# EasyEDA Pro project ProPrj_uHatv1.epro

# Schematic Schematic1
Board Name: Board1; Create Date: 2025-07-15; Page Name: P1; Project Name: OpenIPC Raxda Hat; Schematic Name: Schematic1; Update Date: 2025-07-15; Company: EasyEDA.com; Page Size: A4; Version: V1.0
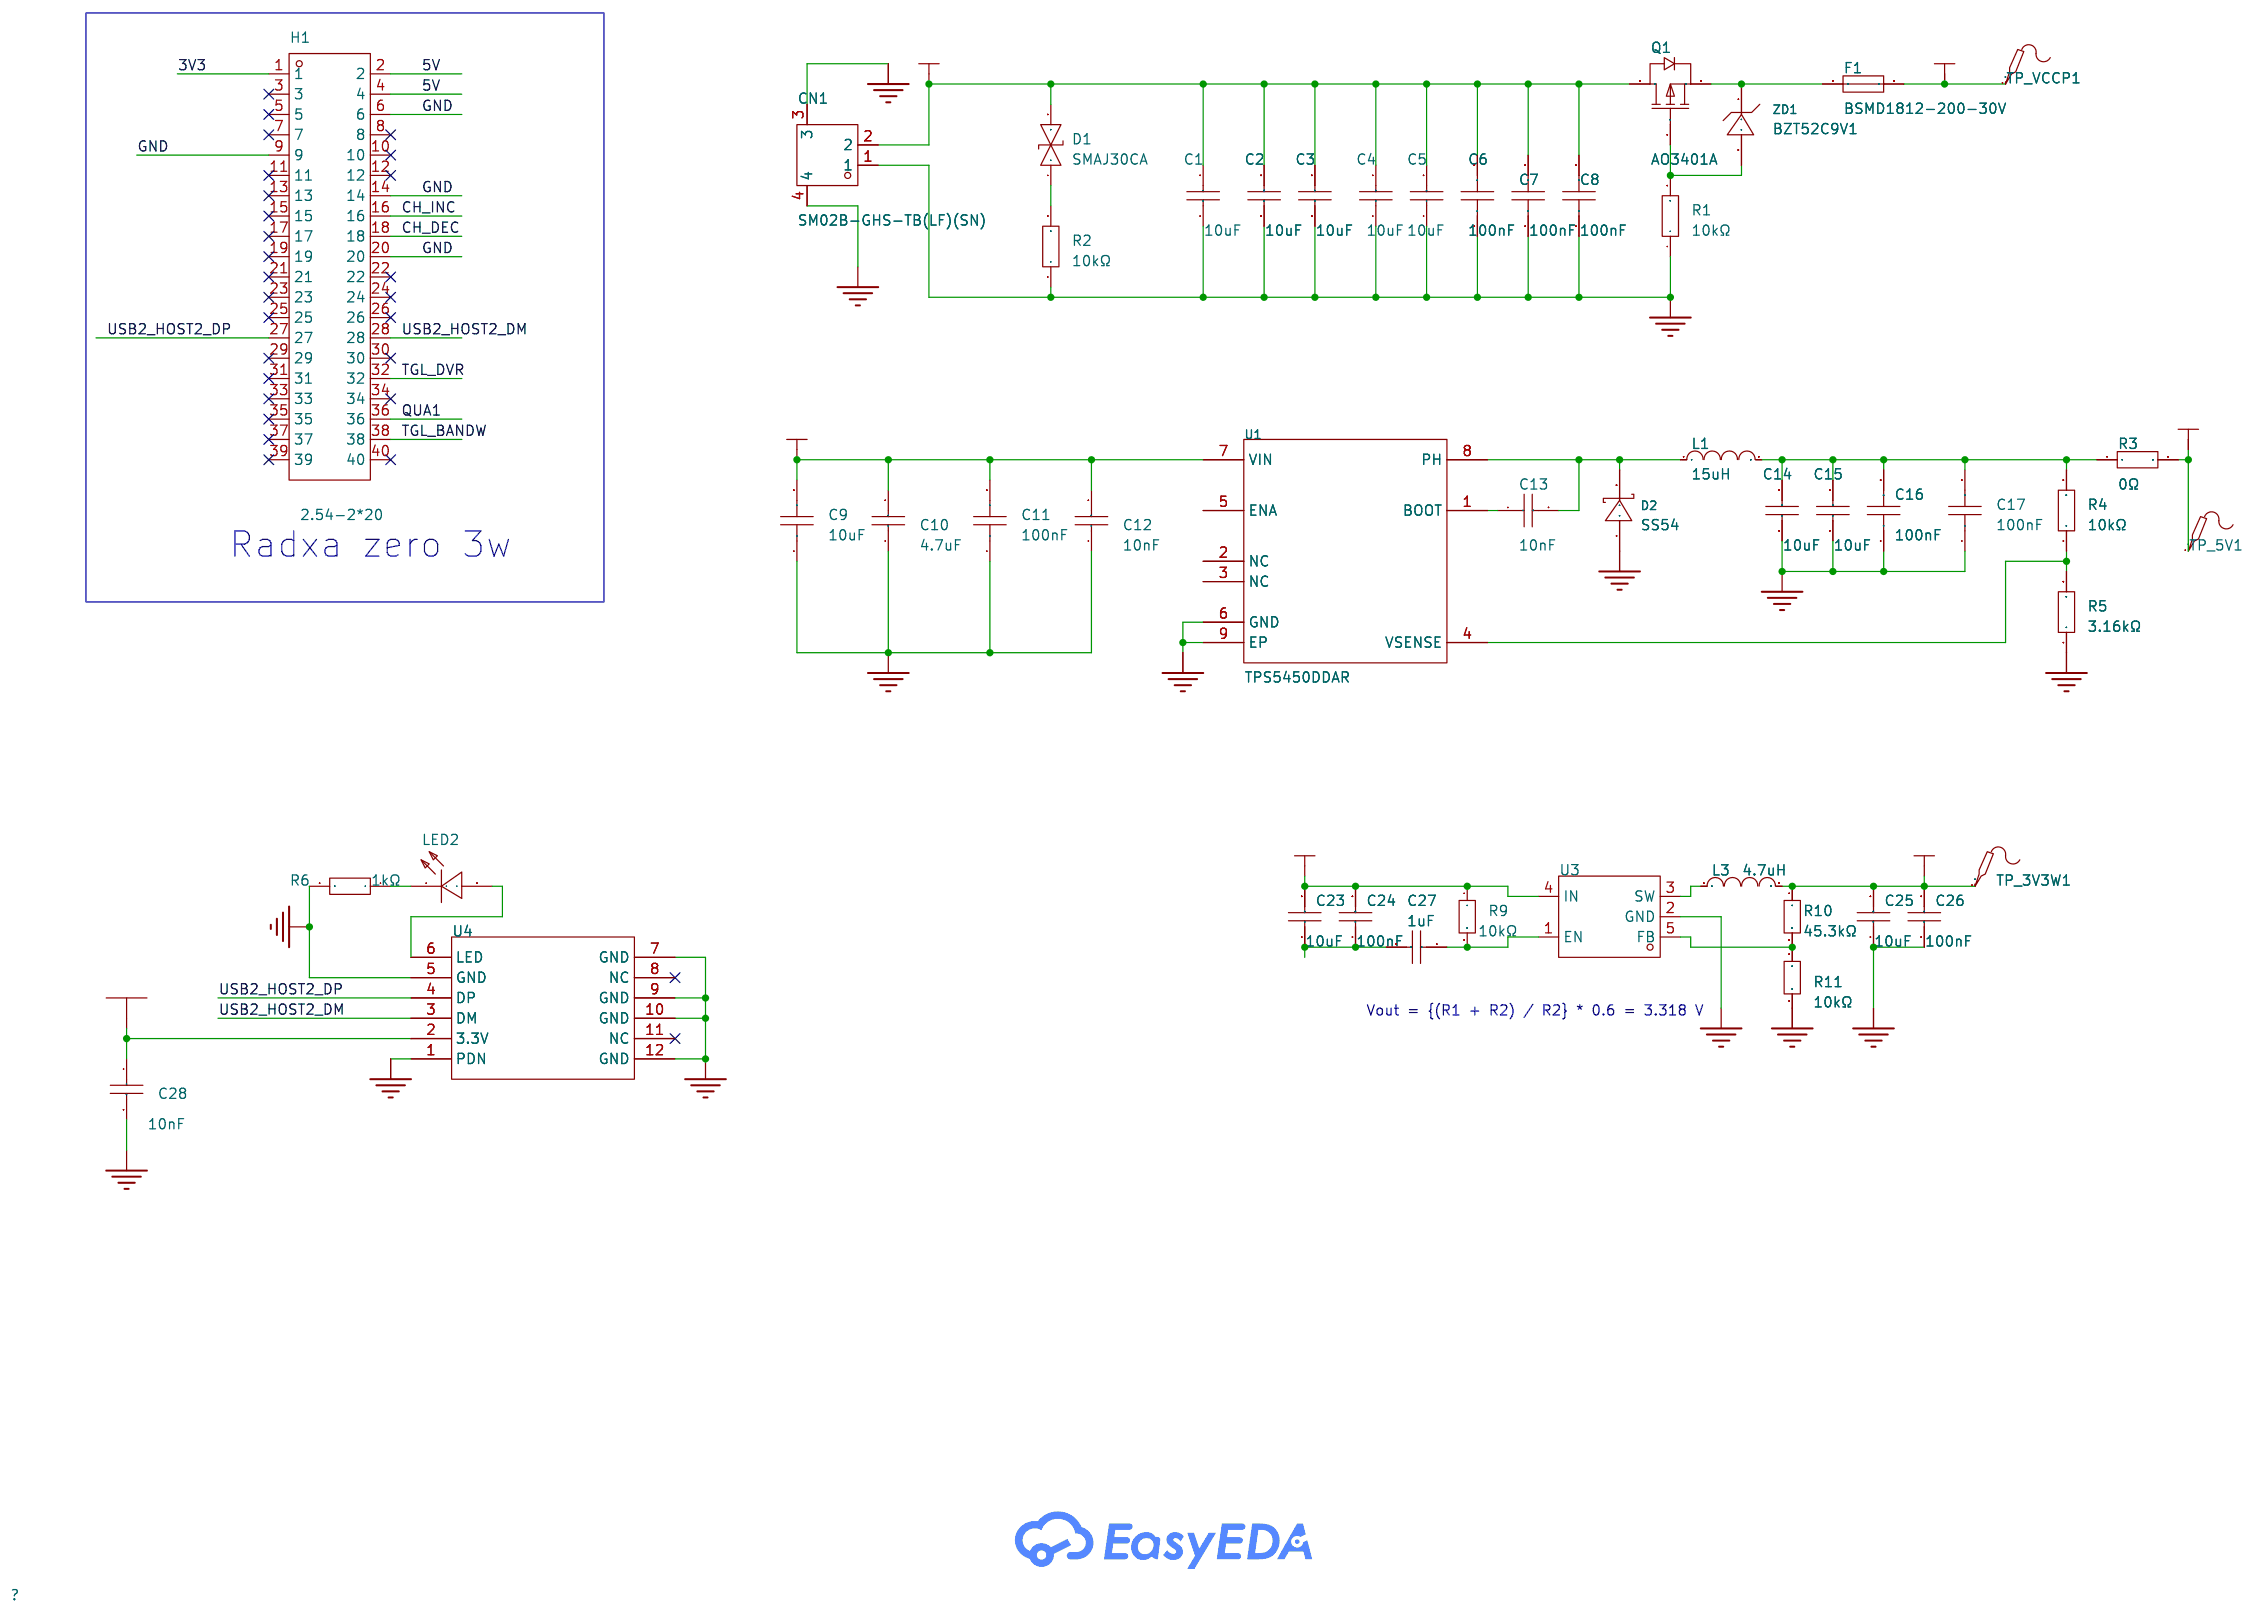
[diagram p0: schematic sheet]

## Parts
C1  10uF  [C1206]
C2  10uF  [C1206]
C3  10uF  [C1206]
C4  10uF  [C1206]
C5  10uF  [C1206]
C6  100nF  [C0603]
C7  100nF  [C0603]
C8  100nF  [C0603]
C9  10uF  [C1206]
C10  4.7uF  [C1206]
C11  100nF  [C0603]
C12  10nF  [C0603]
C13  10nF  [C0603]
C14  10uF  [C1206]
C15  10uF  [C1206]
C16  100nF  [C0603]
C17  100nF  [C0603]
C23  10uF  [C0402]
C24  100nF  [C0402]
C25  10uF  [C0402]
C26  100nF  [C0402]
C27  1uF  [C0402]
C28  10nF  [C0402]
CN1  SM02B-GHS-TB(LF)(SN)  [CONN-SMD_SM02B-GHS-TB-LF-SN]
D1  SMAJ30CA  [SMA_L4.4-W2.6-LS5.0-BI]
D2  SS54  [SMA_L4.3-W2.6-LS5.0-FD]
F1  BSMD1812-200-30V  [F1812]
H1  2.54-2*20  [HDR-TH_40P-P2.54-V-F-R2-C20-S2.54]
L1  15uH  [IND-SMD_L7.3-W6.8]
L3  4.7uH  [L2520]
LED2  NCD0603G1  [LED0603-RD]
Q1  AO3401A  [SOT-23_L2.9-W1.3-P1.90-LS2.4-BR]
R1  10kΩ  [R0603]
R2  10kΩ  [R0603]
R3  0Ω  [R0805]
R4  10kΩ  [R0603]
R5  3.16kΩ  [R0603]
R6  1kΩ  [R0402]
R9  10kΩ  [R0402]
R10  45.3kΩ  [R0402]
R11  10kΩ  [R0402]
TP_3V3W1  -  [Test-Point-0.5mm]
TP_5V1  -  [Test-Point-0.5mm]
TP_VCCP1  -  [Test-Point-0.5mm]
U1  TPS5450DDAR  [SOP-8_L4.9-W3.9-P1.27-LS6.0-BL-EP]
U3  RY3408  [SOT-23-5_L3.0-W1.7-P0.95-LS2.8-BL]
U4  -  [BL-R8812AF1-C]
ZD1  BZT52C9V1  [SOD-123_L2.8-W1.8-LS3.7-RD]

## Library data of the parts
C1-C5 C14 C15 = CL31A106KBHNNNE: 容值:10uF;精度:±10%;额定电压:50V;材质(温度系数):X5R;; LCSC Part Name: 10uF ±10% 50V; Supplier Part: C13585; Manufacturer: SAMSUNG(三星); Supplier Footprint: 1206; JLCPCB Part Class: 基础库; Datasheet: https://atta.szlcsc.com/upload/public/pdf/source/20160103/1457707668742.pdf; Supplier: LCSC; Tolerance: ±10%; Voltage Rated: 50V; Temperature Coefficient: X5R
C6-C8 C11 C16 C17 = CC0603KRX7R9BB104: 容值:100nF;精度:±10%;额定电压:50V;材质(温度系数):X7R;; LCSC Part Name: 100nF ±10% 50V; Supplier Part: C14663; Manufacturer: YAGEO(国巨); Supplier Footprint: 0603; JLCPCB Part Class: Basic Part; Datasheet: https://atta.szlcsc.com/upload/public/pdf/source/20180910/C282072_33301C7F631E79921B82A8DAC6BCC5B3.pdf; Supplier: LCSC; Tolerance: ±10%; Voltage Rated: 50V; Temperature Coefficient: X7R
C9 = CL31B106KBHNNNE: 容值:10uF;精度:±10%;额定电压:50V;材质(温度系数):X7R;; LCSC Part Name: 10uF ±10% 50V; Supplier Part: C89632; Manufacturer: SAMSUNG(三星); Supplier Footprint: 1206; JLCPCB Part Class: Extended Part; Datasheet: https://atta.szlcsc.com/upload/public/pdf/source/20161130/1480498807789.pdf; Supplier: LCSC; Tolerance: ±10%; Voltage Rated: 50V; Temperature Coefficient: X7R
C10 = CL31B475KBHNNNE: 容值:4.7uF;精度:±10%;额定电压:50V;材质(温度系数):X7R;; LCSC Part Name: 4.7uF ±10% 50V; Supplier Part: C51205; Manufacturer: SAMSUNG(三星); Supplier Footprint: 1206; JLCPCB Part Class: 扩展库; Datasheet: https://atta.szlcsc.com/upload/public/pdf/source/20160103/1457707732693.pdf; Supplier: LCSC; Tolerance: ±10%; Voltage Rated: 50V; Temperature Coefficient: X7R
C12 C13 = CC0603KRX7R9BB103: 容值:10nF;精度:±10%;额定电压:50V;材质(温度系数):X7R;; LCSC Part Name: 10nF ±10% 50V; Supplier Part: C100042; Manufacturer: YAGEO(国巨); Supplier Footprint: 0603; JLCPCB Part Class: 扩展库; Datasheet: https://atta.szlcsc.com/upload/public/pdf/source/20180326/C100042_E8B0111D51DE3671A0A4A59FBCEFE81C.pdf; Supplier: LCSC; Tolerance: ±10%; Voltage Rated: 50V; Temperature Coefficient: X7R
C23 C25 = C 0402-10uF: 容值:10uF;精度:±20%;额定电压:6.3V;温度系数:X5R;; LCSC Part Name: 10uF±20%6.3V; Supplier Part: C15525; Manufacturer: SAMSUNG(三星); Manufacturer Part: CL05A106MQ5NUNC; Supplier Footprint: 0402; JLCPCB Part Class: BasicPart; Datasheet: https://atta.szlcsc.com/upload/public/pdf/source/20160103/1457707676445.pdf; Supplier: LCSC; Tolerance: ±20%; Voltage Rated: 6.3V; Temperature Coefficient: X5R
C24 C26 = C 0402-100nF: 容值:100nF;精度:±10%;额定电压:50V;温度系数:X7R;; LCSC Part Name: 100nF±10%50V; Supplier Part: C307331; Manufacturer: SAMSUNG(三星); Manufacturer Part: CL05B104KB54PNC; Supplier Footprint: 0402; JLCPCB Part Class: BasicPart; Datasheet: https://atta.szlcsc.com/upload/public/pdf/source/20181009/C307331_222F7C870FD3EA5F46F538B483443886.pdf; Supplier: LCSC; Tolerance: ±10%; Voltage Rated: 50V; Temperature Coefficient: X7R
C27 = C 0402-1uF: 容值:1uF;精度:±10%;额定电压:25V;温度系数:X5R;; LCSC Part Name: 1uF±10%25V; Supplier Part: C52923; Manufacturer: SAMSUNG(三星); Manufacturer Part: CL05A105KA5NQNC; Supplier Footprint: 0402; JLCPCB Part Class: BasicPart; Datasheet: https://atta.szlcsc.com/upload/public/pdf/source/20160103/1457707735223.pdf; Supplier: LCSC; Tolerance: ±10%; Voltage Rated: 25V; Temperature Coefficient: X5R
C28 = CL05B103KB5NNNC: 容值:10nF;精度:±10%;额定电压:50V;材质(温度系数):X7R;; LCSC Part Name: 10nF ±10% 50V; Supplier Part: C15195; Manufacturer: SAMSUNG(三星); Supplier Footprint: 0402; JLCPCB Part Class: Basic Part; Datasheet: https://atta.szlcsc.com/upload/public/pdf/source/20160218/1457707763339.pdf; Supplier: LCSC; Tolerance: ±10%; Voltage Rated: 50V; Temperature Coefficient: X7R
CN1 = SM02B-GHS-TB(LF)(SN): 插针结构:1x2P;间距:1.25mm;安装方式:卧贴;参考系列:GH;总PIN数:2P;排数:1;每排PIN数:2;行距:-;额定电流:1A;触头材质:磷青铜;触头镀层:锡;工作温度范围:-25℃~+85℃;; LCSC Part Name: 1x2P 间距:1.25mm 卧贴 系列:GH; Supplier Part: C189893; Manufacturer: JST; Supplier Footprint: SMD,P=1.25mm,卧贴; JLCPCB Part Class: Extended Part; Datasheet: https://atta.szlcsc.com/upload/public/pdf/source/20180323/112205B2CF875947C9562BFC7B01FA26.pdf; Supplier: LCSC; Pins Structure: 1x2P; Pitch: 1.25mm; Mounting Style: 卧贴; Reference Series: GH; Number of Pins: 2P; Number of Rows: 1; Number of PINs Per Row: 2; Current Rating (Max): 1A; Contact Material: 磷青铜; Contact Plating: 锡; Operating Temperature Range: -25℃~+85℃; Rated Voltage (Max): 50V; Plastic Material: PA9T; Flame Retardant Rating: UL94V-0; Supplementary Features: 辅助焊脚; Colour: 白色; Z-Height of the Board: 4.25mm; X-Length of Bottom Edge on Board (Spacing Line): 5.75mm; Y-Width of Bottom Edge on Board: 4.13mm
D1 = SMAJ30CA_C110043: 极性:双向;反向截止电压(Vrwm):30V;击穿电压:33.3V;反向漏电流(Ir):1uA;峰值脉冲电流(Ipp)@10/1000μs:8.3A;最大钳位电压:48.4V;; LCSC Part Name: 双向 Vrwm:30V; Supplier Part: C110043; Manufacturer: MDD; Supplier Footprint: SMA(DO-214AC); JLCPCB Part Class: 扩展库; Datasheet: https://atta.szlcsc.com/upload/public/pdf/source/20230314/4319D8044EE29783A53F6AC60595AA71.pdf; Supplier: LCSC; Polarity: 双向; Reverse Stand-Off Voltage (Vrwm): 30V; Breakdown Voltage: 33.3V; Reverse Leakage Current (Ir): 1uA; Peak Pulse Current (Ipp)@10/1000μs: 8.3A; Maximum Clamping Voltage: 48.4V
D2 = SS54_C7420369: 二极管配置:独立式;正向压降(Vf):550mV@5.0A;直流反向耐压(Vr):40V;整流电流:5A;; LCSC Part Name: 电压:40V 电流:5A; Supplier Part: C7420369; Manufacturer: 宏迦橙; Supplier Footprint: SMA(DO-214AC); JLCPCB Part Class: Extended Part; Datasheet: https://atta.szlcsc.com/upload/public/pdf/source/20230828/254C3882F8647358AD9F60DD73611B5E.pdf; Supplier: LCSC; Diode Configuration: 独立式; Forward Voltage (Vf@If): 550mV@5.0A; Reverse Voltage (Vr): 40V; Rectified Current: 5A; Reverse Leakage Current (Ir): 50uA@40V
F1 = BSMD1812-200-30V: 最大电压:30V;最大电流:40A;保持电流:2A;跳闸电流:4A;; LCSC Part Name: 30V 2A 1812自恢复 2秒内动作; Supplier Part: C960026; Manufacturer: BHFUSE(佰宏); Supplier Footprint: 1812; JLCPCB Part Class: Extended Part; Datasheet: https://atta.szlcsc.com/upload/public/pdf/source/20220302/C2BC3E2021B64191B0EAEFE91C1E6D76.pdf; Supplier: LCSC; Operating Voltage (Max): 30V; Current Rating (Max): 40A; Hold Current: 2A; Trip Current: 4A; Power Dissipation: 800mW; Resistance - Initial (Ri) (Min): 20mΩ; Resistance - Post Trip (R1) (Max): 100mΩ; Maximum Time to Trip: 2s; Operating Temperature: -40℃~+85℃
H1 = 2.54-2*20: 插孔结构:2x20P;间距:2.54mm;行距:2.54mm;圆孔/方孔:方孔;安装类型:直插;排数:双排;总孔位数:40P;额定电流:2.5A;额定电压:-;插孔方向:顶部;塑高:8.5mm;工作温度范围:-40℃~+105℃;; LCSC Part Name: 间距:2.54mm 2x20P 直插; Supplier Part: C2977589; Manufacturer: ZHOURI(洲日); Supplier Footprint: 插件,P=2.54mm; JLCPCB Part Class: Extended Part; Datasheet: https://atta.szlcsc.com/upload/public/pdf/source/20220328/834E302BE3C038BBC5C70F5E02589B1E.pdf; Supplier: LCSC; Holes Structure: 2x20P; Pitch: 2.54mm; Row Spacing: 2.54mm; Circular Hole / Square Hole: 方孔; Mounting Type: 直插; Number of Rows: 双排; Number of Holes: 40P; Current Rating (Max): 2.5A; Holes Direction: 顶部; Insulation Height: 8.5mm; Operating Temperature Range: -40℃~+105℃
L1 = MWSA0603S-150MT: 精度:±20%;额定电流:3A;电感值:15uH;直流电阻(DCR):113mΩ;; LCSC Part Name: 15uH ±20%; Supplier Part: C408452; Manufacturer: Sunlord(顺络); Supplier Footprint: SMD; JLCPCB Part Class: Extended Part; Datasheet: https://atta.szlcsc.com/upload/public/pdf/source/20190729/C408452_7F0A9CFF0AB8A0D8AD496F52F1F29DF7.pdf; Supplier: LCSC; Width: 7mm; Tolerance: ±20%; Length: 6.6mm; Height: 3mm; Rated Current: 3A; DC Resistance (DCR): 113mΩ
L3 = SLO252012F4R7MTT: 电感值:4.7uH;精度:±20%;额定电流:1.55A;; LCSC Part Name: 4.7uH ±20%; Supplier Part: C275675; Manufacturer: Sunltech(韩国顺磁); Supplier Footprint: SMD; JLCPCB Part Class: Extended Part; Datasheet: https://atta.szlcsc.com/upload/public/pdf/source/20180827/C275675_14A9C48955D3808CE02CC0CFD834A432.pdf; Supplier: LCSC; Tolerance: ±20%; Rated Current: 1.55A; DC Resistance (DCR): 237mΩ; Saturation Current (Isat): 1.1A
LED2 = NCD0603G1: 发光颜色:翠绿色;正向电压(VF):2.6V~3.6V;功率:72mW;正向电流:10mA;主波长:515nm~530nm;透镜颜色:无色透明透镜;发光强度:330mcd~900mcd;发光角度:130°;工作温度:-30℃~+85℃;; Supplier Part: C84267; Manufacturer: 国星光电; Supplier Footprint: 0603; JLCPCB Part Class: Extended Part; Datasheet: https://atta.szlcsc.com/upload/public/pdf/source/20200820/C84267_04BA7703640BAC111D09F5EFB971FBF3.pdf; Supplier: LCSC; Emitted Color: 翠绿色; Forward Voltage (VF): 2.6V~3.6V; Power Dissipation: 72mW; Forward Current: 10mA; Dominant Wavelength: 515nm~530nm; Lens Color: 无色透明透镜; Luminous Intensity: 330mcd~900mcd; Viewing Angle: 130°; Operating Temperature: -30℃~+85℃; Peak Wavelength: 591nm
Q1 = AO3401A_C15127: 类型:P沟道;漏源电压(Vdss):30V;连续漏极电流(Id):4A;功率(Pd):1.4W;导通电阻(RDS(on)@Vgs,Id):44mΩ@10V,4.3A;; LCSC Part Name: P沟道 30V 4A; Supplier Part: C15127; Manufacturer: AOS; Supplier Footprint: SOT-23-3L; JLCPCB Part Class: 基础库; Datasheet: https://atta.szlcsc.com/upload/public/pdf/source/20160507/1462613609053.pdf; Supplier: LCSC; Type: P沟道; Drain Source Voltage (Vdss): 30V; Continuous Drain Current (Id): 4A; Power Dissipation (Pd): 1.4W; Drain Source On Resistance (RDS(on)@Vgs,Id): 44mΩ@10V,4.3A; Gate Threshold Voltage (Vgs(th)@Id): 1.3V@250uA
R1 R2 R4 = RC0603FR-0710KL: 电阻类型:厚膜电阻;阻值:10kΩ;精度:±1%;功率:100mW;; LCSC Part Name: 10kΩ ±1% 100mW; Supplier Part: C98220; Manufacturer: YAGEO(国巨); Supplier Footprint: 0603; JLCPCB Part Class: Extended Part; Datasheet: https://atta.szlcsc.com/upload/public/pdf/source/20170522/1495423494387.pdf; Supplier: LCSC; Type: 厚膜电阻; Tolerance: ±1%; Power(Watts): 100mW; Temperature Coefficient: ±100ppm/℃; Overload Voltage (Max): 75V; Operating Temperature Range: -55℃~+155℃
R3 = RC0805FR-070RL: 电阻类型:厚膜电阻;阻值:0Ω;精度:-;功率:125mW;; LCSC Part Name: 0Ω 125mW; Supplier Part: C100045; Manufacturer: YAGEO(国巨); Supplier Footprint: 0805; JLCPCB Part Class: Extended Part; Datasheet: https://atta.szlcsc.com/upload/public/pdf/source/20180308/C100045_15204885362631413773.pdf; Supplier: LCSC; Type: 厚膜电阻; Power(Watts): 125mW; Overload Voltage (Max): 150V; Operating Temperature Range: -55℃~+155℃
R5 = RC0603FR-073K16L: 电阻类型:厚膜电阻;阻值:3.16kΩ;精度:±1%;功率:100mW;; LCSC Part Name: 3.16kΩ ±1% 100mW; Supplier Part: C185333; Manufacturer: YAGEO(国巨); Supplier Footprint: 0603; JLCPCB Part Class: Extended Part; Datasheet: https://atta.szlcsc.com/upload/public/pdf/source/20180316/A6294E2A48ABAC6B69EFA6CF57598B5C.pdf; Supplier: LCSC; Type: 厚膜电阻; Tolerance: ±1%; Power(Watts): 100mW; Temperature Coefficient: ±100ppm/℃; Overload Voltage (Max): 75V; Operating Temperature Range: -55℃~+155℃
R6 = 0402WGF1001TCE: 电阻类型:厚膜电阻;阻值:1kΩ;精度:±1%;功率:62.5mW;最大工作电压:50V;温度系数:±100ppm/℃;; LCSC Part Name: 1kΩ ±1% 62.5mW 厚膜电阻; Supplier Part: C11702; Manufacturer: UNI-ROYAL(厚声); Supplier Footprint: 0402; JLCPCB Part Class: Basic Part; Datasheet: https://atta.szlcsc.com/upload/public/pdf/source/20200306/C422600_1E6D84923E4A46A82E41ADD87F860B5C.pdf; Supplier: LCSC; Type: 厚膜电阻; Tolerance: ±1%; Power(Watts): 62.5mW; Overload Voltage (Max): 50V; Temperature Coefficient: ±100ppm/℃; Operating Temperature Range: -55℃~+155℃; Voltage Rated: 50V
R9 = RC0402FR-0710KL: 电阻类型:厚膜电阻;阻值:10kΩ;精度:±1%;功率:62.5mW;最大工作电压:50V;温度系数:±100ppm/℃;; LCSC Part Name: 厚膜电阻 10kΩ ±1% 62.5mW; Supplier Part: C60490; Manufacturer: YAGEO(国巨); Supplier Footprint: 0402; JLCPCB Part Class: Extended Part; Datasheet: https://atta.szlcsc.com/upload/public/pdf/source/20170925/C131467_1506321478108990263.pdf; Supplier: LCSC; Type: 厚膜电阻; Tolerance: ±1%; Power(Watts): 62.5mW; Overload Voltage (Max): 50V; Temperature Coefficient: ±100ppm/℃; Operating Temperature Range: -55℃~+155℃
R10 = 0402WGF4532TCE: 电阻类型:厚膜电阻;阻值:45.3kΩ;精度:±1%;功率:62.5mW;最大工作电压:50V;温度系数:±100ppm/℃;; LCSC Part Name: 45.3kΩ ±1% 62.5mW 厚膜电阻; Supplier Part: C26980; Manufacturer: UNI-ROYAL(厚声); Supplier Footprint: 0402; JLCPCB Part Class: Extended Part; Datasheet: https://atta.szlcsc.com/upload/public/pdf/source/20200306/C422600_1E6D84923E4A46A82E41ADD87F860B5C.pdf; Supplier: LCSC; Type: 厚膜电阻; Tolerance: ±1%; Power(Watts): 62.5mW; Overload Voltage (Max): 50V; Temperature Coefficient: ±100ppm/℃; Operating Temperature Range: -55℃~+155℃
R11 = R0402-10K: 电阻类型:厚膜电阻;阻值:10kΩ;精度:±1%;功率:1/16W;温度系数:±100ppm/;最大工作电压:50V;工作温度范围:-55~+155;; LCSC Part Name: 10kΩ ±1%; Supplier Part: C25744; Manufacturer: UNI-ROYAL(厚声); Manufacturer Part: 0402WGF1002TCE; Supplier Footprint: 0402; JLCPCB Part Class: Basic Part; Datasheet: https://atta.szlcsc.com/upload/public/pdf/source/20200306/C422600_1E6D84923E4A46A82E41ADD87F860B5C.pdf; Supplier: LCSC; Type: 厚膜电阻; Tolerance: ±1%; Power(Watts): 1/16W; Temperature Coefficient: ±100ppm/; Overload Voltage (Max): 50V; Operating Temperature Range: -55~+155
TP_3V3W1 TP_5V1 TP_VCCP1 = Test-Point: Test Point 测试点
U1 = TPS5450DDAR: 功能类型:降压型;同步整流:否;输出类型:可调;输出通道数:1;拓扑结构:降压式;输入电压:5.5V~36V;输出电压:1.221V~31.32V;输出电流(最大值):5A;开关频率:500kHz;工作温度:-40℃~+125℃@(TJ);; LCSC Part Name: 降压型 Vin=5.5V~36V Vout=1.221V~31.32V 5A; Supplier Part: C114425; Manufacturer: TI(德州仪器); Supplier Footprint: SOP-8-EP; JLCPCB Part Class: 扩展库; Datasheet: https://atta.szlcsc.com/upload/public/pdf/source/20170620/1497944765773.pdf; Supplier: LCSC; Function: 降压型; Synchronous Rectification: 否; Output Type: 可调; Number of Outputs: 1; Topology: 降压式; Input Voltage: 5.5V~36V; Output Voltage: 1.221V~31.32V; Output Current (Max): 5A; Switching Frequency: 500kHz; Operating Temperature: -40℃~+125℃@(TJ)
U3 = RY3408: LCSC Part Name: RY3408 Buck, 2.5-5.5V, 1.0A, 1.5MHz, VFB 0.6V, SOT23-5; Supplier Part: C370750; Manufacturer: RYCHiP(蕊源); Supplier Footprint: SOT-23-5; JLCPCB Part Class: Extended Part; Datasheet: https://atta.szlcsc.com/upload/public/pdf/source/20190401/C370750_391097459A1376D00374F95CC0163C7D.pdf; Supplier: LCSC
U4 = BL-R8812AF1
ZD1 = BZT52C9V1_C2123: 二极管配置:独立式;稳压值(标称值):9.1V;稳压值(范围):8.5V~9.6V;精度:-;功率:350mW;; Supplier Part: C2123; Manufacturer: CJ(江苏长电/长晶); Supplier Footprint: SOD-123; JLCPCB Part Class: Extended Part; Datasheet: https://atta.szlcsc.com/upload/public/pdf/source/20120428/1457706480557.pdf; Supplier: LCSC; Diode Configuration: 独立式; Zener Voltage (Nom): 9.1V; Zener Voltage (Range): 8.5V~9.6V; Power Dissipation: 350mW; Reverse Leakage Current (Ir): 500nA@6V; Zener Impedance (Zzt): 15Ω

## Nets
3V3: H1.1
3V3_WF: C25.2 C26.2 C28.1 L3.2 R10.1 TP_3V3W1.1 U4.2(3.3V)
5V: C23.2 C24.2 H1.2 H1.4 R3.2 R9.1 TP_5V1.1 U3.4(IN)
GND: C1.1 C2.1 C3.1 C4.1 C5.1 C6.1 C7.1 C8.1 C9.1 C10.1 C11.1 C12.1 C14.1 C15.1 C16.1 C17.1 C25.1 C26.1 C28.2 CN1.1 CN1.3 CN1.4 D2.1(A) H1.6 H1.9 H1.14 H1.20 R1.1 R2.1 R5.1 R6.2 R11.1 U1.6(GND) U1.9(EP) U3.2(GND) U4.1(PDN) U4.5(GND) U4.7(GND) U4.9(GND) U4.10(GND) U4.12(GND)
VCC_IN: C1.2 C2.2 C3.2 C4.2 C5.2 C6.2 C7.2 C8.2 CN1.2 D1.2 Q1.3(D)
VCC_P: C9.2 C10.2 C11.2 C12.2 F1.2 TP_VCCP1.1 U1.7(VIN)
CH_DEC: H1.18
CH_INC: H1.16
QUA1: H1.36
TGL_BANDW: H1.38
TGL_DVR: H1.32
USB2_HOST2_DM: H1.28 U4.3(DM)
USB2_HOST2_DP: H1.27 U4.4(DP)
$1N718: C13.1 U1.1(BOOT)
$1N720: C13.2 D2.2(K) L1.1 U1.8(PH)
$1N722: R4.1 R5.2 U1.4(VSENSE)
$1N724: C14.2 C15.2 C16.2 C17.2 L1.2 R3.1 R4.2
$1N1789: Q1.1(G) R1.2 ZD1.2(A)
$1N1790: D1.1 R2.2
$1N1792: F1.1 Q1.2(S) ZD1.1(K)
$1N2681: R10.2 R11.2 U3.5(FB)
$1N2683: C23.1 C24.1 C27.2
$1N2685: C27.1 R9.2 U3.1(EN)
$1N2687: L3.1 U3.3(SW)
$1N3406: LED2.1(K) R6.1
$1N3407: LED2.2(A) U4.6(LED)

Not connected (* = marked no-connect by the designer): H1 3* 5* 7* 8* 10* 11* 12* 13* 15* 17* 19* 21* 22* 23* 24* 25* 26* 29* 30* 31* 33* 34* 35* 37* 39* 40*; U1 2(NC) 3(NC) 5(ENA); U4 8(NC)* 11(NC)*

## Notes on the sheet
- Radxa zero 3w
- Vout = {(R1 + R2) / R2} * 0.6 = 3.318 V

# Board PCB1
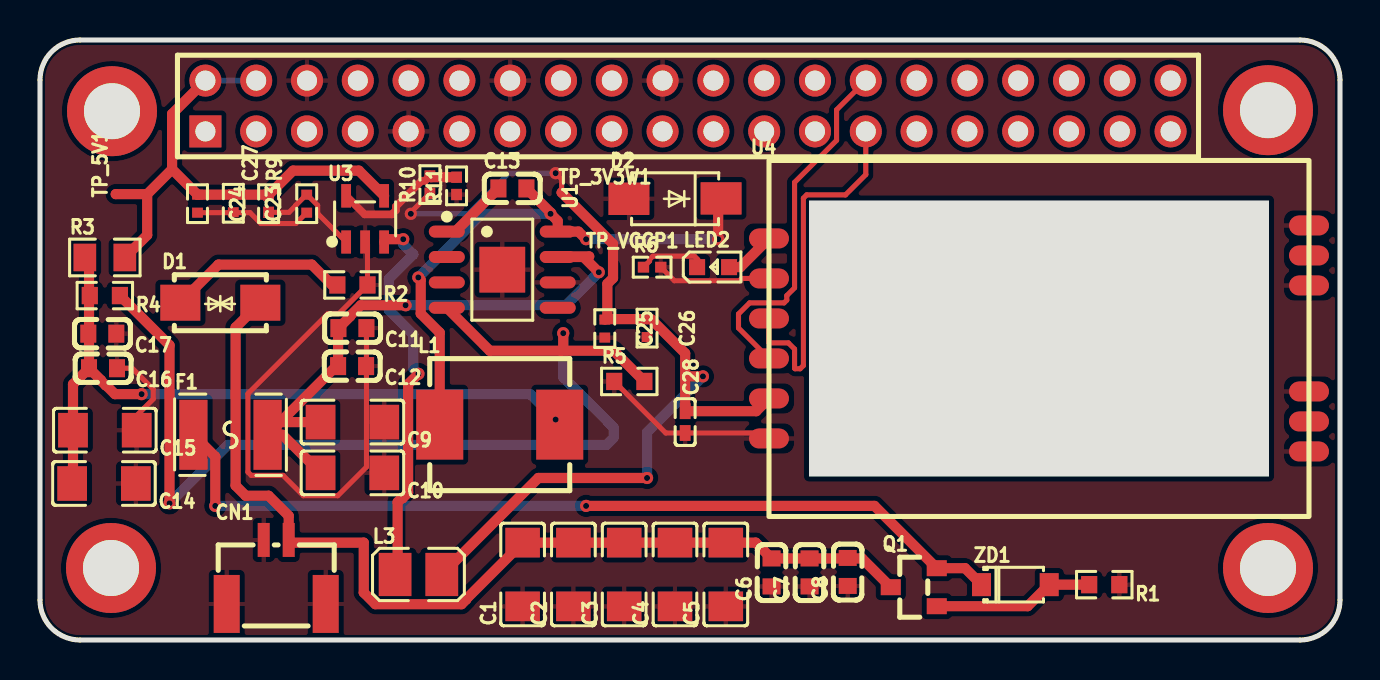
[diagram p1: board, top side]
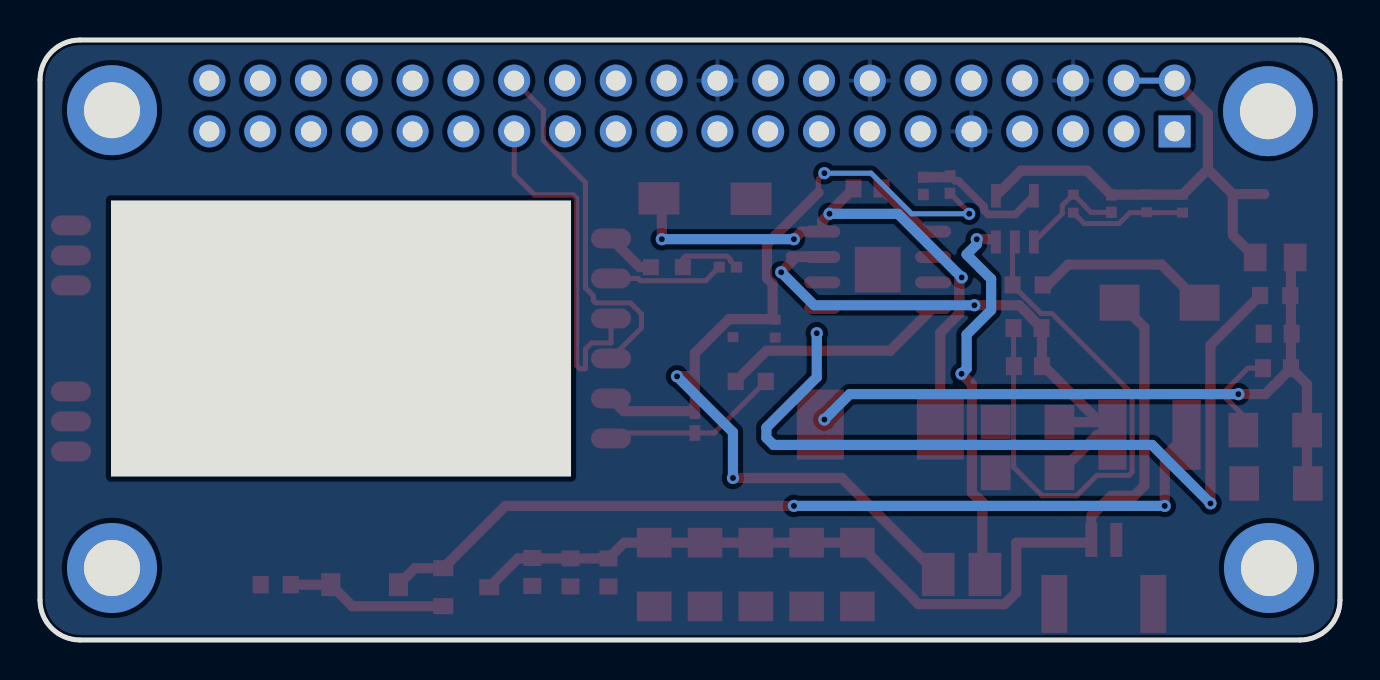
[diagram p2: board, bottom side, seen from below]

Outline 65 x 30 mm; copper layers: Top Layer, Inner1, Inner2, Bottom Layer. Coordinates in mm from the lower left corner of the outline.
Outline path: 0,28 0,2 arc(0.59,0.59) 2,0 63,0 arc(64.41,0.59) 65,2 65,28 arc(64.41,29.41) 63,30 2,30 arc(0.59,29.41) 0,28
Stack: Top Layer 0.035mm / Dielectric1 1.51mm FR4 er 4.5 / Inner1 0.035mm / Dielectric2 0.48mm PP er 4.5 / Inner2 0.035mm / Dielectric3 0.48mm PP er 4.5 / Bottom Layer 0.035mm

## Design rules (mm)
net USB2_HOST2_DM: DP1
net USB2_HOST2_DP: DP1
template: JLCPCB Capability(Two Layers Board)
spacing copperThickness1oz (default): track to track 0.102, other pairs 0.152 to 0.3
spacing copperThickness2oz: track to track 0.203, other pairs 0.152 to 0.3
track width copperThickness1oz (default): min 0.127, default 0.254, max 2.54
track width copperThickness2oz: min 0.203, default 0.254, max 2.54
differential pair differentialPair (default): width min 0.127, default 0.254, max 2.54; gap min 0.152, default 0.152
via viaSize (default): diameter min 0.5, default 0.61, max 10; hole min 0.3, default 0.305, max 6.3

## Placement (name value [footprint] x y rotation side)
C1  10uF  [C1206]  24.13 3.28 90 top
C2  10uF  [C1206]  26.67 3.28 90 top
C3  10uF  [C1206]  29.21 3.28 90 top
C4  10uF  [C1206]  31.75 3.28 90 top
C5  10uF  [C1206]  34.29 3.28 90 top
C6  100nF  [C0603]  36.58 3.38 90 top
C7  100nF  [C0603]  38.48 3.38 90 top
C8  100nF  [C0603]  40.39 3.4 90 top
C9  10uF  [C1206]  15.62 10.9 180 top
C10  4.7uF  [C1206]  15.62 8.36 180 top
C11  100nF  [C0603]  15.62 15.59 180 top
C12  10nF  [C0603]  15.61 13.7 180 top
C13  10nF  [C0603]  23.62 22.58 0 top
C14  10uF  [C1206]  3.2 7.83 180 top
C15  10uF  [C1206]  3.24 10.49 180 top
C16  100nF  [C0603]  3.15 13.59 180 top
C17  100nF  [C0603]  3.12 15.32 180 top
C23  10uF  [C0402#2]  9.67 21.84 90 top
C24  100nF  [C0402#2]  7.87 21.82 90 top
C25  10uF  [C0402#2]  28.24 15.57 90 top
C26  100nF  [C0402#2]  30.35 15.59 90 top
C27  1uF  [C0402#2]  13.33 21.82 270 top
C28  10nF  [C0402]  32.26 10.9 270 top
CN1  SM02B-GHS-TB(LF)(SN)  [CONN-SMD_SM02B-GHS-TB-LF-SN]  11.81 3.4 0 top
D1  SMAJ30CA  [SMA_L4.4-W2.6-LS5.0-BI]  9.02 16.86 0 top
D2  SS54  [SMA_L4.3-W2.6-LS5.0-FD]  31.75 22.07 0 top
F1  BSMD1812-200-30V  [F1812]  9.52 10.26 0 top
H1  2.54-2*20  [HDR-TH_40P-P2.54-V-F-R2-C20-S2.54]  32.4 26.7 0 top
L1  15uH  [IND-SMD_L7.3-W6.8]  22.99 10.77 0 top
L3  4.7uH  [L2520]  18.92 3.28 0 top
LED2  NCD0603G1  [LED0603-RD]  33.66 18.64 0 top
NOREF  -  [Pad_e369]  61.4 26.49 0 top
NOREF#2  -  [Pad_e368]  61.4 3.6 0 top
NOREF#3  -  [Pad_e367]  3.6 26.44 0 top
NOREF#4  -  [Pad_e366]  3.55 3.6 0 top
Q1  AO3401A  [SOT-23_L2.9-W1.3-P1.90-LS2.4-BR]  43.69 2.64 0 top
R1  10kΩ  [R0603]  53.21 2.77 180 top
R2  10kΩ  [R0603]  15.62 17.75 180 top
R3  0Ω  [R0805]  3.24 19.13 0 top
R4  10kΩ  [R0603]  3.24 17.22 180 top
R5  3.16kΩ  [R0603]  29.46 12.93 0 top
R6  1kΩ  [R0402]  30.61 18.64 0 top
R9  10kΩ  [R0402]  11.43 21.82 270 top
R10  45.3kΩ  [R0402]  19.49 22.77 90 top
R11  10kΩ  [R0402]  20.83 22.71 90 top
TP_3V3W1  -  [Test-Point-0.5mm]  26.08 22.37 0 top
TP_5V1  -  [Test-Point-0.5mm]  3.79 22.29 90 top
TP_VCCP1  -  [Test-Point-0.5mm]  27.46 19.18 0 top
U1  TPS5450DDAR  [SOP-8_L4.9-W3.9-P1.27-LS6.0-BL-EP]  23.11 18.52 270 top
U3  RY3408  [SOT-23-5_L3.0-W1.7-P0.95-LS2.8-BL]  16.26 21.06 0 top
U4  -  [BL-R8812AF1-C]  36.45 23.98 0 top
ZD1  BZT52C9V1  [SOD-123_L2.8-W1.8-LS3.7-RD]  48.77 2.77 0 top

## Footprints (pads in the part's own frame, mm; a bottom-side part is the same pattern mirrored in y, then rotated)
BL-R8812AF1-C
  rrect 2x1 smd: 1(0,-13.9) 2(0,-11.9) 3(0,-9.9) 4(0,-7.9) 5(0,-5.9) 6(0,-3.9) 7(27,-3.25) 8(27,-4.75) 9(27,-6.25) 10(27,-11.55) 11(27,-13.05) 12(27,-14.55)
C0402
  rect 0.79x0.54 smd: 1(-0.545,0) 2(0.545,0)
C0402#2
  rect 0.5x0.54 smd: 1(-0.45,0) 2(0.45,0)
C0603
  rect 0.8x0.9 smd: 1(-0.7,0) 2(0.7,0)
C1206
  rect 1.485x1.728 smd: 1(-1.593,0) 2(1.593,0)
CONN-SMD_SM02B-GHS-TB-LF-SN
  rect 0.6x1.7 smd: 1(-0.625,1.6) 2(0.625,1.6)
  rect 1.3x2.9 smd: 3(2.475,-1.6) 4(-2.475,-1.6)
F1812
  rect 1.407x3.499 smd: 1(-1.853,0) 2(1.853,0)
HDR-TH_40P-P2.54-V-F-R2-C20-S2.54
  rect 1.6x1.6 hole 1: 1(-24.13,-1.27)
  round 1.6 hole 1: 2(-24.13,1.27) 3(-21.59,-1.27) 4(-21.59,1.27) 5(-19.05,-1.27) 6(-19.05,1.27) 7(-16.51,-1.27) 8(-16.51,1.27) 9(-13.97,-1.27) 10(-13.97,1.27) 11(-11.43,-1.27) 12(-11.43,1.27) 13(-8.89,-1.27) 14(-8.89,1.27) 15(-6.35,-1.27) 16(-6.35,1.27) 17(-3.81,-1.27) 18(-3.81,1.27) 19(-1.27,-1.27) 20(-1.27,1.27) 21(1.27,-1.27) 22(1.27,1.27) 23(3.81,-1.27) 24(3.81,1.27) 25(6.35,-1.27) 26(6.35,1.27) 27(8.89,-1.27) 28(8.89,1.27) 29(11.43,-1.27) 30(11.43,1.27) 31(13.97,-1.27) 32(13.97,1.27) 33(16.51,-1.27) 34(16.51,1.27) 35(19.05,-1.27) 36(19.05,1.27) 37(21.59,-1.27) 38(21.59,1.27) 39(24.13,-1.27) 40(24.13,1.27)
IND-SMD_L7.3-W6.8
  rect 2.35x3.5 smd: 1(-3,0) 2(3,0)
L2520
  rect 1.635x2.16 smd: 1(-1.167,0) 2(1.167,0)
LED0603-RD
  rect 0.8x0.8 smd: 1(-0.799,0) 2(0.799,0)
Pad_e366
  round 4.5 hole 2.8: (0,0)
Pad_e367
  round 4.5 hole 2.8: (0,0)
Pad_e368
  round 4.5 hole 2.8: (0,0)
Pad_e369
  round 4.5 hole 2.8: (0,0)
R0402
  rect 0.566x0.54 smd: 1(-0.433,0) 2(0.433,0)
R0603
  rect 0.806x0.864 smd: 1(-0.753,0) 2(0.753,0)
R0805
  rect 1.133x1.377 smd: 1(-1,0) 2(1,0)
SMA_L4.3-W2.6-LS5.0-FD
  rect 2.046x1.62 smd: 1(-2.304,-0.009) 2(2.304,0.009)
SMA_L4.4-W2.6-LS5.0-BI
  rect 2x1.8 smd: 1(-2,0) 2(2,0)
SOD-123_L2.8-W1.8-LS3.7-RD
  rect 0.95x1.15 smd: 1(-1.692,0) 2(1.692,0)
SOP-8_L4.9-W3.9-P1.27-LS6.0-BL-EP
  oval 0.6x1.8 smd: 1(-1.905,-2.772) 2(-0.635,-2.772) 3(0.635,-2.772) 4(1.905,-2.772) 5(1.905,2.772) 6(0.635,2.772) 7(-0.635,2.772) 8(-1.905,2.772)
  rect 2.29x2.29 smd: 9(0,0)
SOT-23-5_L3.0-W1.7-P0.95-LS2.8-BL
  rect 0.49x1.157 smd: 1(-0.95,-1.153) 2(0,-1.153) 3(0.95,-1.153)
  rect 0.49x1.175 smd: 4(0.95,1.153) 5(-0.95,1.153)
SOT-23_L2.9-W1.3-P1.90-LS2.4-BR
  rect 1x0.8 smd: 1(1.15,-0.95) 2(1.15,0.95) 3(-1.15,0)
Test-Point-0.5mm
  round 0.5 smd: 1(0,0)

## Nets
As in the schematic.

Pads without a net: H1 3 5 7 8 10 11 12 13 15 17 19 21 22 23 24 25 26 29 30 31 33 34 35 37 39 40; U1 2 3 5; U4 8 11

## Via types
v1: diameter 0.61, hole 0.305, Top Layer to Bottom Layer, 18 vias

## Routing (per net, layer and track width the routed paths; a pad name or vN(x,y) marks a point on that pad's centre or on a via; arc(x,y) is an arc through that point)
3V3_WF: length 49.6
  Top Layer w0.254: v1(18.54,21.31) 18.54,21.38 R10.1 ; TP_3V3W1.1 26.08,23.04 v1(25.78,23.34)
  Top Layer w0.508: 32.26,13.13 32.31,13.18 v1(33.15,13.18) ; 32.26,13.13 32.26,14.33 30.55,16.04 C26.2 28.27,16.04 ; 32.26,13.13 C28.1 35.81,11.44 U4.2 ; 28.27,16.04 28.37,16.15 28.37,17.81 28.65,18.09 28.65,19.8 TP_3V3W1.1 ; 28.27,16.04 C25.2 ; v1(30.35,8.1) 24.92,8.1 L3.2
  Bottom Layer w0.254: v1(25.78,23.34) 23.45,23.34 21.42,21.31 v1(18.54,21.31)
  Bottom Layer w0.508: v1(33.15,13.18) 30.35,10.39 v1(30.35,8.1)
5V: length 26.8
  Top Layer w0.508: H1.2 6.6,26.3 6.6,23.54 ; U3.4 15.95,23.47 12.65,23.47 R9.1 11.41,22.27 7.89,22.27 ; 7.88,22.26 C24.2 6.6,23.54 ; 6.6,23.54 5.36,22.29 ; 5.36,22.29 5.36,20.24 R3.2 ; 5.36,22.29 TP_5V1.1
  Bottom Layer w0.3: 10.81,27.97 H1.2
GND: length 47.6
  Top Layer w0.254: U3.2 16.37,19.78 R2.1 14.94,16.32 14.41,16.32 10.4,12.31 10.4,8.4 10.56,8.23 12.15,8.23 13.17,7.21 14.89,7.21 16.32,8.65 C11.1 ; U4.5 35.08,18.08 34.97,17.96 31.72,17.96 R6.2 ; C15.1 4.83,11.22 5.66,12.05 5.66,12.53 4.61,13.59 C16.1 ; R5.1 31.29,10.35 C28.2 36.17,10.35 U4.1
VCC_IN: length 49.3
  Top Layer w0.508: Q1.3 41.1,4.08 C7.2 C6.2 35.79,4.87 C5.2 C4.2 C3.2 C2.2 C1.2 21.31,2.05 21.31,2.03 21.08,1.79 16.77,1.79 16.19,2.37 16.19,4.87 12.57,4.87 CN1.2 12.44,6.21 11.43,7.21 10.29,7.21 9.78,7.72 9.78,15.63 D1.2
VCC_P: length 30.5
  Top Layer w0.508: v1(18.28,16.74) 16.04,16.74 15.52,16.21 15.52,16.19 C11.2 14.91,15.58 C12.2 14.81,13.7 12.01,10.9 ; v1(27.94,18.39) 27.18,19.15 U1.7 25.91,19.18 TP_VCCP1.1 ; 12.01,10.9 F1.2 12.12,10.26 C10.2 ; 12.01,10.9 C9.2
  Bottom Layer w0.508: v1(18.28,16.74) 26.29,16.74 v1(27.94,18.39)
USB2_HOST2_DM: length 18.2
  Top Layer w0.254: H1.28 39.83,26.51 39.83,24.98 37.73,22.88 37.73,17.61 37.34,17.22 37.34,16.99 37.2,16.86 35.48,16.86 34.92,16.3 34.92,15.6 U4.3
USB2_HOST2_DP: length 18.2
  Top Layer w0.254: H1.27 41.29,23.27 40.27,22.26 38.33,22.26 38.17,22.09 38.17,13.72 38.01,13.56 37.75,13.56 37.73,13.59 37.73,14.55 37.42,14.86 36.46,14.86 36.45,14.87 U4.4
$1N718: length 3.5
  Top Layer w0.508: C13.1 20.76,20.42 U1.1
$1N720: length 28.8
  Top Layer w0.508: v1(33.91,20.04) 33.91,21.94 D2.2 ; L1.1 19.99,15.37 19.04,16.32 19.04,18.01 v1(18.92,18.13) ; C13.2 25.53,21.37 v1(25.53,21.31) 25.89,20.95 U1.8 26.92,20.42 v1(27.3,20.04)
  Bottom Layer w0.508: v1(27.3,20.04) v1(33.91,20.04) ; v1(18.92,18.13) 22.1,21.31 v1(25.53,21.31)
$1N722: length 53.6
  Top Layer w0.508: R4.1 6.48,14.74 v1(6.48,6.83) ; 26.05,14.46 28.68,14.46 R5.2 ; 26.05,14.46 26.16,14.57 v1(26.16,15.34) ; 26.05,14.46 22.49,14.46 U1.4
  Bottom Layer w0.508: v1(6.48,6.83) 9.4,9.75 28.32,9.75 28.68,10.11 28.68,10.62 26.16,13.14 v1(26.16,15.34)
$1N724: length 36.5
  Top Layer w0.508: v1(25.78,11.02) 25.99,10.82 L1.2 ; v1(5.08,12.29) 3.75,12.29 3.31,12.73 3.28,12.73 3.05,12.97 3.05,13 C16.2 ; C14.2 1.65,7.87 C15.2 1.65,12.79 C16.2 ; R3.1 2.45,18.92 C16.2
  Bottom Layer w0.508: v1(5.08,12.29) 24.51,12.29 v1(25.78,11.02)
$1N1789: length 8.1
  Top Layer w0.508: Q1.1 49.38,1.69 ZD1.2 R1.2
$1N1790: length 9.1
  Top Layer w0.508: D1.1 8.92,18.77 13.59,18.77 14.61,17.75 R2.2
$1N1792: length 44
  Top Layer w0.508: v1(27.3,6.7) 41.72,6.7 Q1.2 46.25,3.59 ZD1.1 ; v1(8.76,6.7) 8.76,9.17 F1.1
  Bottom Layer w0.508: v1(27.3,6.7) v1(8.76,6.7)
$1N2681: length 6.8
  Top Layer w0.381: 15.31,22.21 16.24,21.28 17.59,21.28 17.79,21.48 17.79,21.67 19.08,22.96 19.25,22.96 R10.2
  Top Layer w0.508: R11.2 19.56,23.14 R10.2
$1N2683: length 5.9
  Top Layer w0.254: C24.1 10.5,21.37 11.04,20.82 12.79,20.82 C27.2
$1N2685: length 5.5
  Top Layer w0.254: R9.2 12.45,21.38 12.79,21.72 12.79,21.73 13.32,22.27 C27.1 13.35,22.27 13.88,21.73 13.88,21.32 15.31,19.9
$1N2687: length 19.6
  Top Layer w0.508: v1(18.92,13.31) 18.41,12.79 18.41,7.37 18.12,7.09 18.07,7.09 17.88,6.9 17.88,3.4 L3.1 ; v1(18.16,20.04) 17.34,20.04 U3.3
  Bottom Layer w0.508: v1(18.16,20.04) 18.16,19.79 18.67,19.28 17.44,18.05 17.44,16.5 18.67,15.27 18.67,13.56 v1(18.92,13.31)
$1N3406: length 3.1
  Top Layer w0.254: 30.17,18.64 30.48,18.95 30.48,19.03 30.64,19.19 32.73,19.19 32.89,19.02
$1N3407: length 2.6
  Top Layer w0.508: LED2.2 35.02,18.64 U4.6

## Copper pours and planes (outline as drawn; the poured copper is in the pictures)
GND on Top Layer: -4.31,59.8 71.25,59.8 71.25,-7.11 -4.31,-7.11
GND on Top Layer: -0.89,30.58 66.29,30.58 66.29,-0.92 -0.89,-0.92
GND on Bottom Layer: -9.4,37.85 72.26,37.85 72.26,-7.11 -9.4,-7.11
GND on Inner2: 66.42,143.38 143.26,143.38 143.26,85.34 66.42,85.34
